# Altium schematic sheet DEBUG.SchDoc
size Letter; DrawnBy: Titan Yuan; SheetNumber: 8; SheetTotal: 8
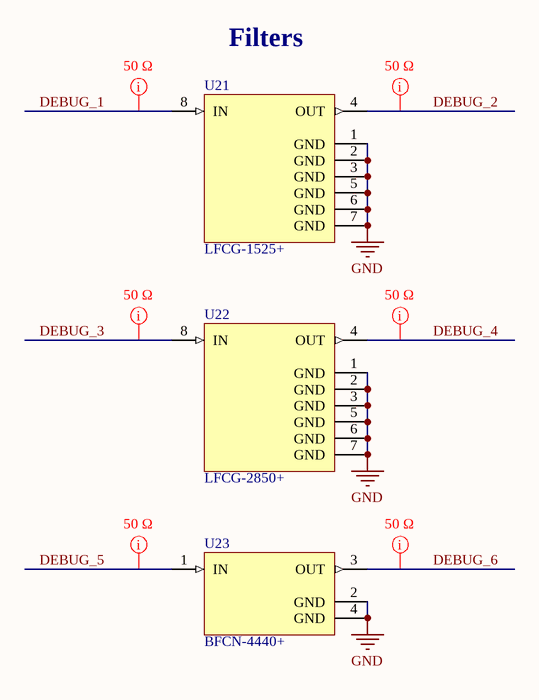
[diagram p0: DEBUG.SchDoc]

## Parts
U21  LFCG-1525+  [PL-429]
U22  LFCG-2850+  [PL-429]
U23  BFCN-4440+  [FV1206]

## Nets
GND: U21.1(GND) U21.2(GND) U21.3(GND) U21.5(GND) U21.6(GND) U21.7(GND) U22.1(GND) U22.2(GND) U22.3(GND) U22.5(GND) U22.6(GND) U22.7(GND) U23.2(GND) U23.4(GND)
DEBUG_1: U21.8(IN)
DEBUG_2: U21.4(OUT)
DEBUG_3: U22.8(IN)
DEBUG_4: U22.4(OUT)
DEBUG_5: U23.1(IN)
DEBUG_6: U23.3(OUT)

## Layout directives
net class 50 Ω: DEBUG_1, DEBUG_2, DEBUG_3, DEBUG_4, DEBUG_5, DEBUG_6

## Notes on the sheet
- (near U21) Filters

## Library data of the parts
U21 = LFCG-1525+: Ceramic LPF, 1 Section(s) Min, 1 Section(s) Max; Manufacturer: Mini-Circuits; Cutoff Frequency: 1.525GHz; Manufacturer Part Number: LFCG-1525+; Supplier: DigiKey; Supplier Part Number: 3157-LFCG-1525+CT-ND; RoHS: Compliant; Category: Ceramic Filters; Stock: 1035; Pricing: 1=13.73, 20=6.696, 50=6.42, 100=6, 200=5.448, 500=4.896, 1000=4.092, 2000=3.8556 (USD); Introduction Date: 2020-08-28; Lifecycle Status: Production; ComponentLink1URL: https://datasheet.octopart.com:443/LFCG-1525%2B-Mini-Circuits-datasheet-180701239.pdf?src-supplier=IHS; ComponentLink1Description: https://datasheet.octopart.com:443/LFCG-1525%2B-Mini-Circuits-datasheet-180701239.pdf?src-supplier=IHS
U22 = LFCG-2850+: 1.8dB 50Ω 2.85GHz 0805 SMD mount 2mm*1.25mm*950μm; Manufacturer: Mini-Circuits; Cutoff Frequency: 3.25GHz; Manufacturer Part Number: LFCG-2850+; Supplier: DigiKey; Supplier Part Number: 3157-LFCG-2850+CT-ND; RoHS: Compliant; Category: Ceramic Filters; Stock: 1260; Pricing: 1=14.41, 20=7.032, 50=6.744, 100=6.3, 200=5.724, 500=5.136 (USD); Export Control Classification Number (ECCN) Code: EAR99; Height: 950µm; Insertion Loss (dB): 1.8dB; Introduction Date: 2018-10-03; Length: 2mm; Lifecycle Status: Production; Max Operating Temperature: 85°C; Min Operating Temperature: -40°C; Mounting Technology: Surface Mount; REACH SVHC: Yes; Width: 1.25mm; ComponentLink1URL: https://datasheet.octopart.com:443/LFCG-2850%2B-Mini-Circuits-datasheet-180701242.pdf?src-supplier=IHS; ComponentLink1Description: https://datasheet.octopart.com:443/LFCG-2850%2B-Mini-Circuits-datasheet-180701242.pdf?src-supplier=IHS
U23 = BFCN-4440+: Ceramic BPF, 1 Section(s) Min, 1 Section(s) Max, 4440MHz; Manufacturer: Mini-Circuits; Cutoff Frequency: 4.44GHz; Insertion Loss (dB): 2dB; Manufacturer Part Number: BFCN-4440+; Supplier: DigiKey; Supplier Part Number: 3157-BFCN-4440+CT-ND; RoHS: Compliant; Category: Ceramic Filters; Stock: 3974; Pricing: 1=14.95, 20=6.6, 50=6.3, 100=5.988, 200=5.29205, 500=5.13602, 1000=5.1255 (USD); Export Control Classification Number (ECCN) Code: EAR99; Height: 940µm; Introduction Date: 2008-02-14; Length: 3.2mm; Lifecycle Status: Production; Max Operating Temperature: 100°C; Min Operating Temperature: -55°C; REACH SVHC: Yes; Width: 1.6mm; ComponentLink1URL: https://datasheet.octopart.com:443/BFCN-4440%2B-Mini-Circuits-datasheet-62330094.pdf?src-supplier=Component+Distributors+Inc.; ComponentLink1Description: https://datasheet.octopart.com:443/BFCN-4440%2B-Mini-Circuits-datasheet-62330094.pdf?src-supplier=Component+Distributors+Inc.